# EAGLE design DualEncoderBoard-revd (EAGLE 8.2.2)
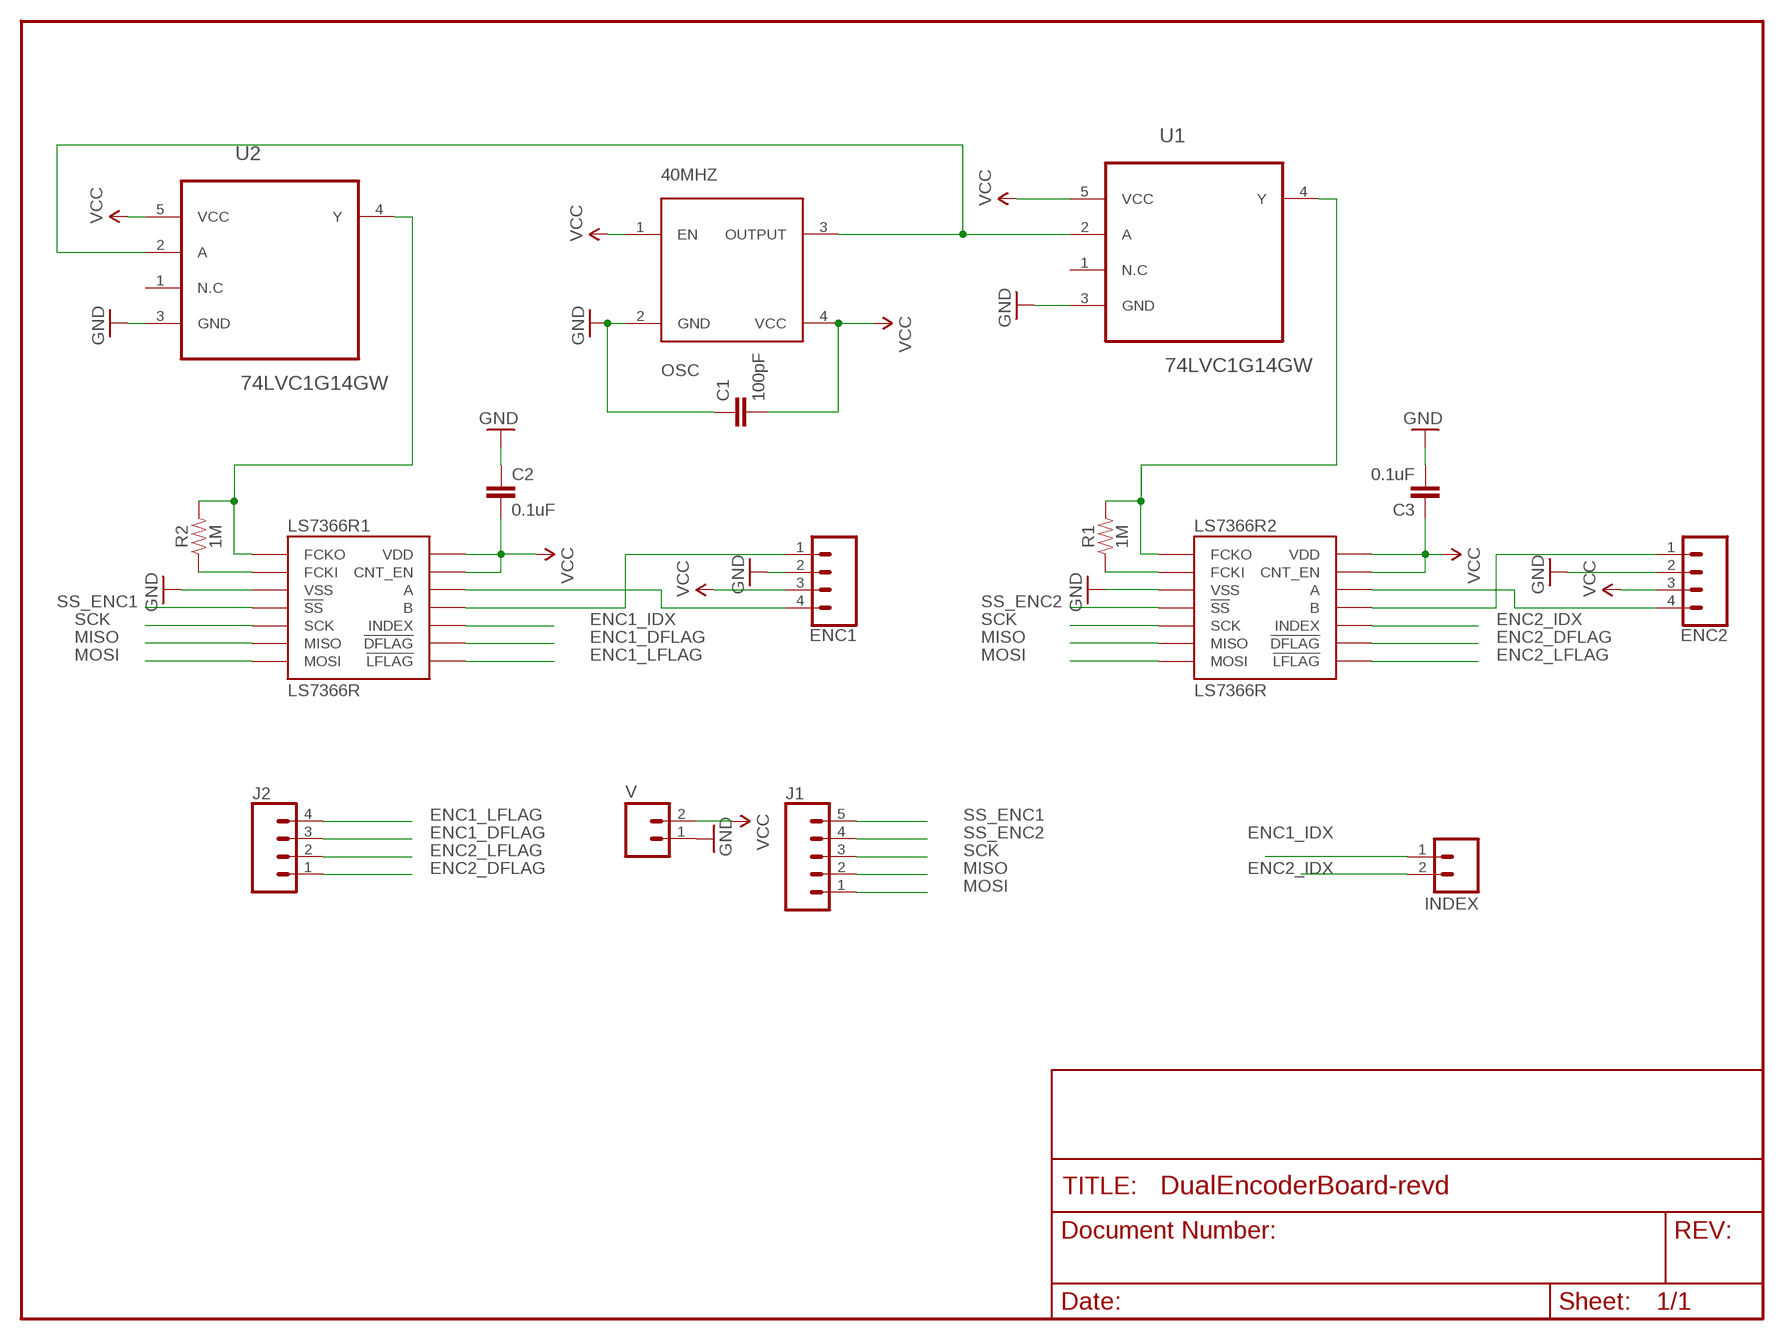
[diagram p0: schematic, sheet 1]

## Parts
40MHZ  OSC  [CB3OSCILLATOR]
C1  100pF  100PF-0603-50V-5%  [0603]
C2  0.1uF  0.1UF-0603-25V-5%  [0603]
C3  0.1uF  0.1UF-0603-25V-5%  [0603]
ENC1  CONN_04  [1X04]
ENC2  CONN_04  [1X04]
INDEX  M02PTH  [1X02]
J1  CONN_05  [1X05]
J2  CONN_04  [1X04]
LS7366R1  LS7366R  [SOIC14]
LS7366R2  LS7366R  [SOIC14]
R1  1M  1MOHM-0603-1/4W-5%  [0603]
R2  1M  1MOHM-0603-1/4W-5%  [0603]
U1  74LVC1G14GW  [SOT65P210X110-5N]
U2  74LVC1G14GW  [SOT65P210X110-5N]
V  M02-JST-2MM-SMT  [JST-2-SMD]

## Nets
ENC1_DFLAG: J2.3 LS7366R1.9(!DFLAG)
ENC1_IDX: INDEX.1 LS7366R1.10(INDEX)
ENC1_LFLAG: J2.4 LS7366R1.8(!LFLAG)
ENC2_DFLAG: J2.1 LS7366R2.9(!DFLAG)
ENC2_IDX: INDEX.2 LS7366R2.10(INDEX)
ENC2_LFLAG: J2.2 LS7366R2.8(!LFLAG)
GND: 40MHZ.2(GND) C1.1 C2.1 C3.2 ENC1.2 ENC2.2 LS7366R1.3(VSS) LS7366R2.3(VSS) U1.3(GND) U2.3(GND) V.1
MISO: J1.2 LS7366R1.6(MISO) LS7366R2.6(MISO)
MOSI: J1.1 LS7366R1.7(MOSI) LS7366R2.7(MOSI)
N$1: ENC1.4 LS7366R1.12(A)
N$2: ENC1.1 LS7366R1.11(B)
N$3: ENC2.4 LS7366R2.12(A)
N$4: ENC2.1 LS7366R2.11(B)
N$6: LS7366R1.2(FCKI) R2.1
N$7: 40MHZ.3(OUTPUT) U1.2(A) U2.2(A)
N$8: LS7366R2.1(FCKO) R1.2 U1.4(Y)
N$9: LS7366R2.2(FCKI) R1.1
N$10: LS7366R1.1(FCKO) R2.2 U2.4(Y)
SCK: J1.3 LS7366R1.5(SCK) LS7366R2.5(SCK)
SS_ENC1: J1.5 LS7366R1.4(!SS)
SS_ENC2: J1.4 LS7366R2.4(!SS)
VCC: 40MHZ.1(EN) 40MHZ.4(VCC) C1.2 C2.2 C3.1 ENC1.3 ENC2.3 LS7366R1.13(CNT_EN) LS7366R1.14(VDD) LS7366R2.13(CNT_EN) LS7366R2.14(VDD) U1.5(VCC) U2.5(VCC) V.2
Unconnected: U1.1(N.C) U2.1(N.C)

## Library data of the parts
40MHZ = steveo:OSC: CB3 40mhz Oscillator smd
C1 = SparkFun-Capacitors:100PF: 100pF/0.1nF ceramic capacitors A capacitor is a passive two-terminal electrical component used to store electrical energy temporarily in an electric field.; PROD_ID: CAP-07883
C2 C3 = SparkFun-Capacitors:0.1UF: 0.1µF ceramic capacitors A capacitor is a passive two-terminal electrical component used to store electrical energy temporarily in an electric field.; PROD_ID: CAP-08604
ENC1 ENC2 J2 = SparkFun-Connectors:CONN_04: Multi connection point. Often used as Generic Header-pin footprint for 0.1 inch spaced/style header connections On any of the 0.1 inch spaced packages, you can populate with these: Break Away Headers - Straight <https://www.sparkfun.com/products/116> (PRT-00116) Break Away Male Headers - Right Angle <https://www.sparkfun.com/products/553> (PRT-00553) Female Headers <https://www.sparkfun.com/products/115> (PRT-00115) Break Away Headers - Machine Pin <https://www.sparkfun.com/products/117> (PRT-00117) Break Away Female Headers - Swiss Machine Pin <https://www.sparkfun.com/products/743> (PRT-00743) For SCREWTERMINALS and SPRING TERMINALS visit here: Screw Terimnals on SparkFun.com <https://www.sparkfun.com/search/results?term=Screw+Terminals> (5mm/3.5mm/2.54mm spacing) This device is also useful as a general connection point to wire up your design to another part of your project. Our various solder wires solder well into these plated through hole pads. Hook-Up Wire - Assortment (Stranded, 22 AWG) <https://www.sparkfun.com/products/11375> (PRT-11375) Hook-Up Wire - Assortment (Solid Core, 22 AWG) <https://www.sparkfun.com/products/11367> (PRT-11367) View the entire wire category on our website here <https://www.sparkfun.com/categories/141> Special notes: Molex polarized connector foot print use with SKU : PRT-08231 with associated crimp pins and housings. 1MM SMD Version SKU: PRT-10208; PROD_ID: CONN-09696
INDEX V = SparkFun:M02: Header 2 Standard 2-pin 0.1" header. Use with straight break away headers (SKU : PRT-00116), right angle break away headers (PRT-00553), swiss pins (PRT-00743), machine pins (PRT-00117), and female headers (PRT-00115). Molex polarized connector foot print use with SKU : PRT-08233 with associated crimp pins and housings.
J1 = SparkFun-Connectors:CONN_05: Multi connection point. Often used as Generic Header-pin footprint for 0.1 inch spaced/style header connections On any of the 0.1 inch spaced packages, you can populate with these: Break Away Headers - Straight <https://www.sparkfun.com/products/116> (PRT-00116) Break Away Male Headers - Right Angle <https://www.sparkfun.com/products/553> (PRT-00553) Female Headers <https://www.sparkfun.com/products/115> (PRT-00115) Break Away Headers - Machine Pin <https://www.sparkfun.com/products/117> (PRT-00117) Break Away Female Headers - Swiss Machine Pin <https://www.sparkfun.com/products/743> (PRT-00743) For SCREWTERMINALS and SPRING TERMINALS visit here: Screw Terimnals on SparkFun.com <https://www.sparkfun.com/search/results?term=Screw+Terminals> (5mm/3.5mm/2.54mm spacing) This device is also useful as a general connection point to wire up your design to another part of your project. Our various solder wires solder well into these plated through hole pads. Hook-Up Wire - Assortment (Stranded, 22 AWG) <https://www.sparkfun.com/products/11375> (PRT-11375) Hook-Up Wire - Assortment (Solid Core, 22 AWG) <https://www.sparkfun.com/products/11367> (PRT-11367) View the entire wire category on our website here <https://www.sparkfun.com/categories/141> Special notes: Molex polarized connector foot print use with SKU : PRT-08231 with associated crimp pins and housings. 1MM SMD Version SKU: PRT-10208
LS7366R1 LS7366R2 = LS7366R:LS7366R; AVAILABILITY: Unavailable; MF: LSI; MP: LS7366R; PACKAGE: None; PRICE: None
R1 R2 = SparkFun-Resistors:1MOHM: 1MΩ resistor A resistor is a passive two-terminal electrical component that implements electrical resistance as a circuit element. Resistors act to reduce current flow, and, at the same time, act to lower voltage levels within circuits. - Wikipedia; PROD_ID: RES-07868
U1 U2 = 74LVC1G14GW:74LVC1G14GW: Single Schmitt-trigger inverter; AVAILABILITY: Unavailable; DESCRIPTION: IC MOS 74LVC1G14/SO/74LVC1G14GW PHILIPS RoHS LVC SOt23; MF: NXP Semiconductors; MP: 74LVC1G14GW; PACKAGE: TSSOP-5 NXP Semiconductors; PRICE: 214.47 USD

## Board
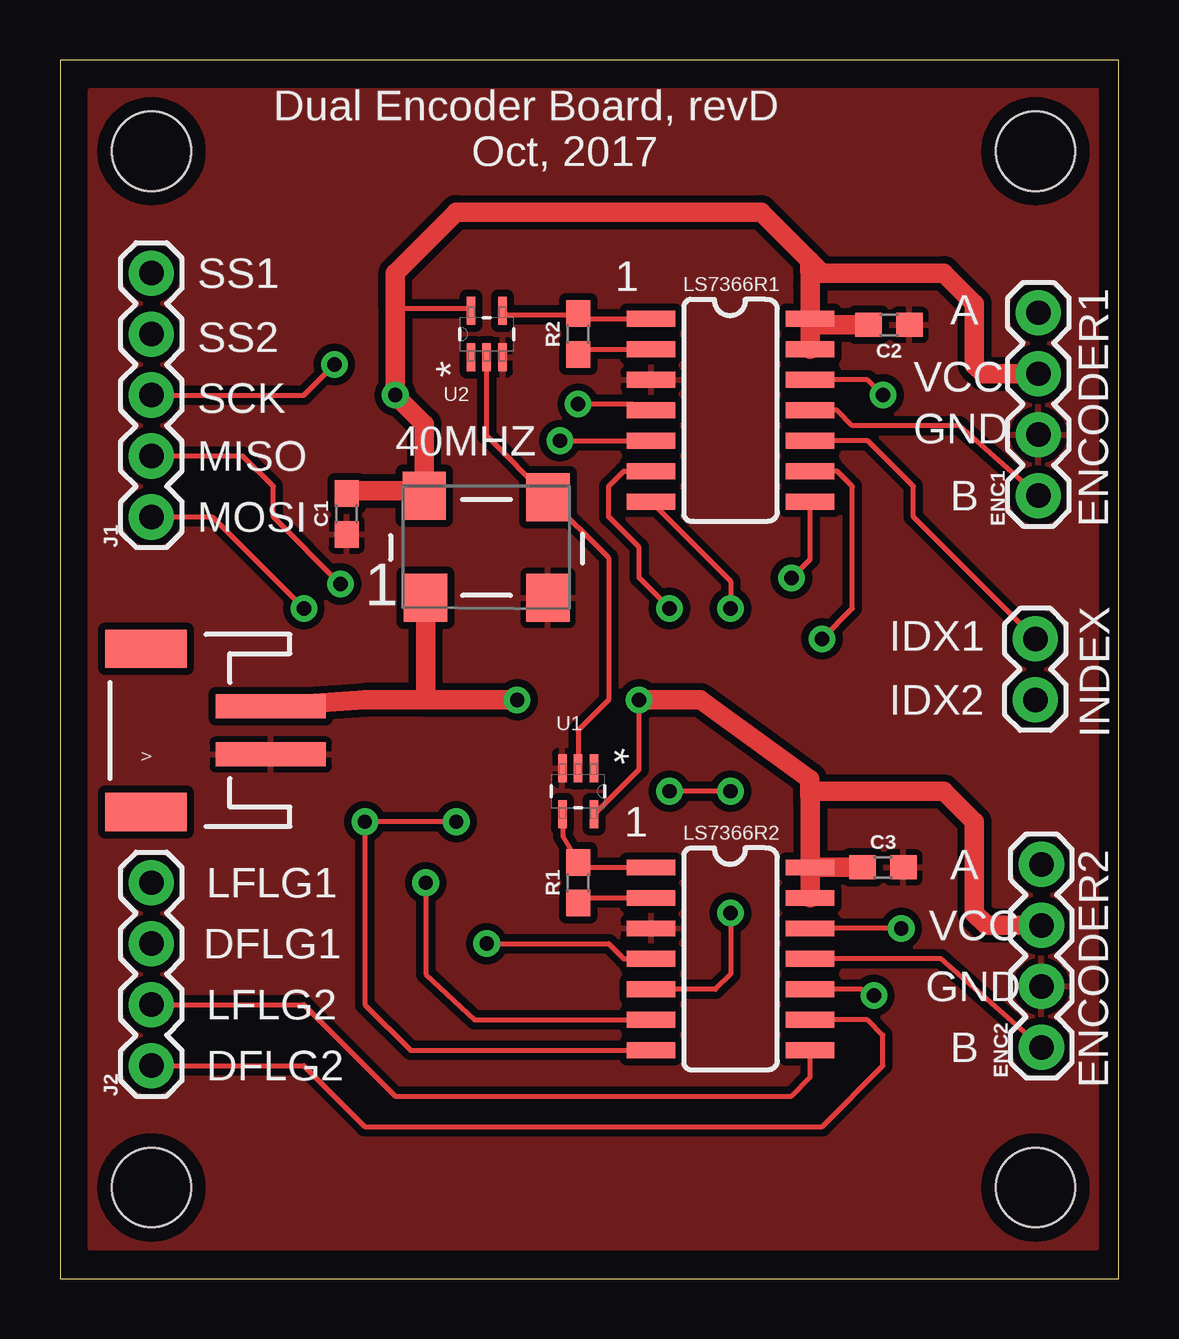
[diagram p1: board, top side]
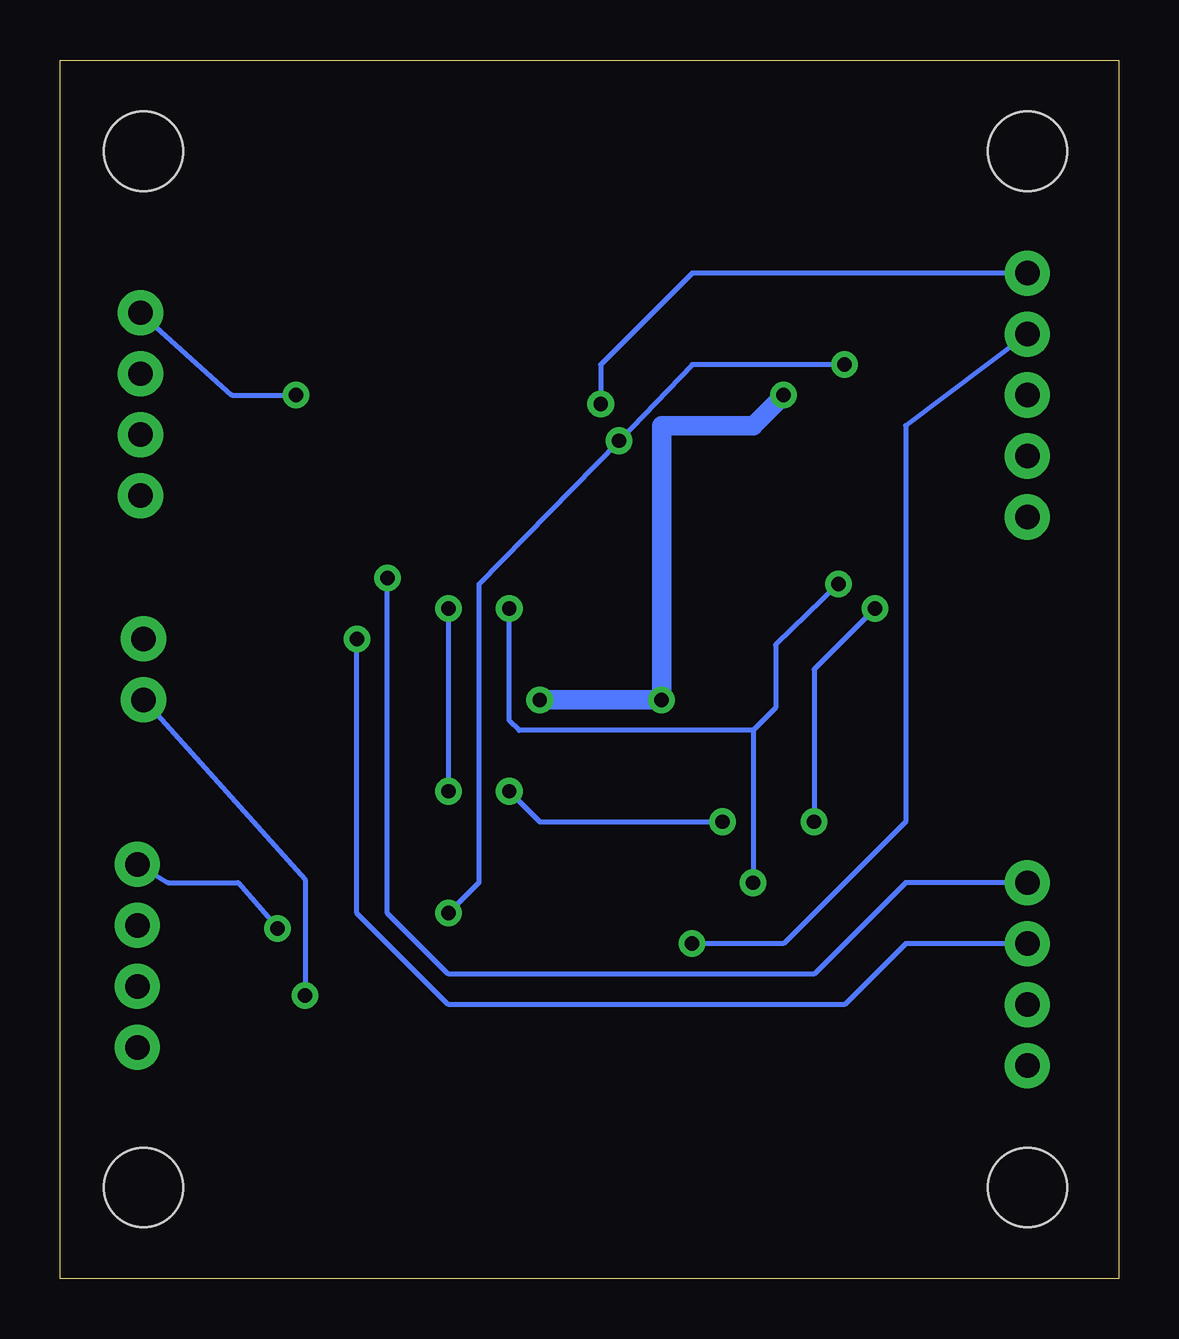
[diagram p2: board, bottom side, seen from below]

Size 44.12 x 50.79 mm. Coordinates in mm from the lower left corner, seen from the top.
Outline: 0,0 44.12,0 44.12,50.79 0,50.79 0,0
Copper layers (1*16): Top 0.035mm / dielectric 1.5mm / Bottom 0.035mm
Design rules "SparkFun": minimum track width 8mil, minimum drill 20mil, track to track 8mil, track to pad 8mil, pad to pad 8mil, via to via 8mil, smd to smd 8mil, copper to edge 8mil, drill to drill 8mil, minimum pad ring 12mil, minimum via ring 10mil, stop-mask expansion 4mil, vias tented up to drill 20mil, thermal gap 10mil

### Footprints (pad centres in the part's own frame; a part is rotated, then mirrored left to right if it is on the bottom)
CB3OSCILLATOR = smd 1.8 x 2: 1 -2.55,-2.1; 2 2.55,-2.1; 3 2.55,2.1; 4 -2.6,2.15
0603 = smd 1.1 x 1: 1 -0.85,0; 2 0.85,0
1X04 = drill 1.016 pad 1.88: 1 0,0; 2 2.54,0; 3 5.08,0; 4 7.62,0
1X02 = drill 1.016 pad 1.88: 1 0,0; 2 2.54,0
1X05 = drill 1.016 pad 1.88: 1 0,0; 2 2.54,0; 3 5.08,0; 4 7.62,0; 5 10.16,0
SOIC14 = smd 2.032 x 0.66: 1 -3.315,4.445; 2 -3.315,3.175; 3 -3.315,1.905; 4 -3.315,0.635; 5 -3.315,-0.635; 6 -3.315,-1.905; 7 -3.315,-3.175; 8 3.315,-3.175; 9 3.315,-1.905; 10 3.315,-0.635; 11 3.315,0.635; 12 3.315,1.905; 13 3.315,3.175; 14 3.315,4.445
SOT65P210X110-5N = smd 1.168 x 0.356: 1 -0.965,0.66; 2 -0.965,0; 3 -0.965,-0.66; 4 0.965,-0.66; 5 0.965,0.66
STAND-OFF = hole 3.302: 0,0
JST-2-SMD = smd 1 x 4.6: 1 -1,-3.7; 2 1,-3.7 | smd 1.6 x 3.4: NC1 -3.4,1.5; NC2 3.4,1.5

### Placement (x,y rotation side)
40MHZ  17.78,30.48 0 top
C1  11.94,31.88 90 top
C2  34.54,39.75 180 top
C3  34.29,17.14 0 top
ENC1  40.77,32.64 90 top
ENC2  40.89,9.65 90 top
INDEX  40.64,26.67 270 top
J1  3.81,31.75 90 top
J2  3.81,8.89 90 top
LS7366R1  27.94,35.56 0 top
LS7366R2  27.94,12.7 0 top
R1  21.59,16.51 90 top
R2  21.59,39.37 90 top
U1  21.59,20.32 270 top
U2  17.78,39.37 90 top
U$1  [STAND-OFF]  3.81,46.99 0 top
U$2  [STAND-OFF]  3.81,3.81 0 top
U$3  [STAND-OFF]  40.64,3.81 0 top
U$4  [STAND-OFF]  40.64,46.99 0 top
V  5.08,22.86 90 top

### Tracks (layer width: path | path; a pad name or v marks a point on that pad's centre or on a via)
ENC1_DFLAG  (via drill 0.6)
  Top 0.203: v31.75,26.67 33.02,27.94 33.02,33.02 32.38,33.66 LS7366R1.9
  Bottom 0.203: J2.3 8.89,13.97 11.43,11.43 27.94,11.43 31.75,15.24 v31.75,26.67
ENC1_IDX
  Top 0.203: INDEX.1 35.56,31.75 35.56,33.02 33.66,34.92 LS7366R1.10
ENC1_LFLAG  (via drill 0.6)
  Top 0.203: v30.48,29.21 31.25,29.98 LS7366R1.8
  Bottom 0.203: J2.4 8.89,16.51 12.7,12.7 27.94,12.7 30.48,15.24 v30.48,29.21
ENC2_DFLAG
  Top 0.203: J2.1 10.16,8.89 12.7,6.35 31.75,6.35 34.29,8.89 34.29,10.16 33.66,10.79 LS7366R2.9
ENC2_IDX  (via drill 0.6)
  Top 0.203: v33.91,11.81 33.4,12.06 LS7366R2.10
  Bottom 0.203: INDEX.2 33.91,16.64 v33.91,11.81
ENC2_LFLAG
  Top 0.203: J2.2 10.16,11.43 13.97,7.62 30.48,7.62 31.25,8.39 LS7366R2.8
GND
  pour Top (isolate 0.305): 1.27,49.53 43.18,49.53 43.18,1.27 1.27,1.27
MISO  (via drill 0.6)
  Top 0.203: v11.68,28.96 8.89,31.75 8.89,33.02 7.62,34.29 J1.2 | v15.24,16.51 15.24,12.7 17.27,10.79 LS7366R2.6 | v25.4,27.94 24.13,29.21 24.13,30.48 22.86,31.75 22.86,33.02 23.5,33.66 LS7366R1.6
  Bottom 0.203: v11.68,28.96 14.3,26.42 14.3,23.8 15.24,22.86 | 15.24,22.86 v15.24,16.51 | 15.24,22.86 24.99,22.86 25.4,23.27 v25.4,27.94
MOSI  (via drill 0.6)
  Top 0.203: J1.1 6.35,31.75 v10.16,27.94 | LS7366R2.7 14.61,9.53 12.7,11.43 v12.7,19.05 v16.51,19.05 | LS7366R1.7 27.94,29.07 v27.94,27.94 | v27.94,20.32 v25.4,20.32
  Bottom 0.203: v10.16,27.94 12.7,25.4 v12.7,19.05 | v27.94,27.94 v27.94,20.32 | v25.4,20.32 24.13,19.05 v16.51,19.05
N$1  (via drill 0.6)
  Top 0.203: v34.29,36.83 33.66,37.47 LS7366R1.12
  Bottom 0.203: ENC1.4 36.96,36.83 v34.29,36.83
N$2
  Top 0.203: ENC1.1 37.47,35.56 33.02,35.56 32.38,36.2 LS7366R1.11
N$3  (via drill 0.6)
  Top 0.203: v35.05,14.61 LS7366R2.12
  Bottom 0.203: ENC2.4 39.62,16.51 36.7,16.51 v35.05,14.61
N$4
  Top 0.203: ENC2.1 36.7,13.34 LS7366R2.11
N$6
  Top 0.203: R2.1 21.8,38.73 LS7366R1.2
N$7
  Top 0.203: U1.2 21.59,22.86 22.86,24.13 22.86,30.05 40MHZ.3 17.78,35.13 U2.2
N$8
  Top 0.203: LS7366R2.1 21.8,17.14 R1.2 20.95,18.44 U1.4
N$9
  Top 0.203: R1.1 21.8,15.88 LS7366R2.2
N$10
  Top 0.203: 21.64,40.17 R2.2 | 21.64,40.17 21.8,40.01 LS7366R1.1 | U2.4 18.6,40.17 21.64,40.17
SCK  (via drill 0.6)
  Top 0.203: J1.3 10.16,36.83 v11.43,38.1 | v20.83,34.92 LS7366R1.5 | v27.94,15.24 27.94,12.7 27.3,12.06 LS7366R2.5
  Bottom 0.203: v11.43,38.1 17.78,38.1 v20.83,34.92 26.67,28.96 26.67,16.51 v27.94,15.24
SS_ENC1  (via drill 0.6)
  Top 0.203: LS7366R1.4 23.86,36.45 v21.59,36.45
  Bottom 0.203: J1.5 17.78,41.91 21.59,38.1 v21.59,36.45
SS_ENC2  (via drill 0.6)
  Top 0.203: v17.78,13.97 22.86,13.97 23.5,13.34 LS7366R2.4
  Bottom 0.203: J1.4 8.89,35.56 8.89,19.05 13.97,13.97 v17.78,13.97
VCC  (via drill 0.6)
  Top 0.203: U2.5 17.03,40.42 13.97,40.42 | U1.5 24.13,21.23 v24.13,24.13
  Top 0.813: V.2 12.7,24.13 15.24,24.13 | 15.24,24.13 v19.05,24.13 | v24.13,24.13 26.67,24.13 31.24,20.83 31.25,20.31 | 15.24,24.13 40MHZ.1 | 15.18,32.84 15.18,35.62 v13.97,36.83 13.97,40.42 13.97,41.91 16.51,44.45 29.21,44.45 31.24,42.42 | 15.18,32.84 40MHZ.4 | C1.2 12.05,32.84 15.18,32.84 | 31.24,42.42 31.25,41.41 LS7366R1.14 | LS7366R1.14 LS7366R1.13 | LS7366R1.14 31.51,39.75 C2.2 | LS7366R2.14 C3.1 | LS7366R2.14 LS7366R2.13 | 31.25,20.31 31.25,19.82 LS7366R2.14 | 31.24,42.42 31.75,41.91 36.83,41.91 38.1,40.64 38.1,38.1 38.48,37.72 ENC1.3 | 31.25,20.31 31.25,20.32 36.83,20.32 38.1,19.05 38.1,15.24 38.61,14.73 ENC2.3
  Bottom 0.813: v24.13,24.13 v19.05,24.13 19.05,35.56 15.24,35.56 v13.97,36.83

### Text on the board
tPlace: Dual Encoder Board, revD | Oct, 2017 | SS1 | 1 | ENCODER1 | A | SS2 | VCC | SCK | GND | MISO | B | MOSI | 1 | IDX1 | IDX2 | 1 | ENCODER2 | A | LFLG1 | VCC | DFLG1 | GND | LFLG2 | B | DFLG2